# EAGLE schematic stern-dreieck-anlauf (EAGLE 6.0)
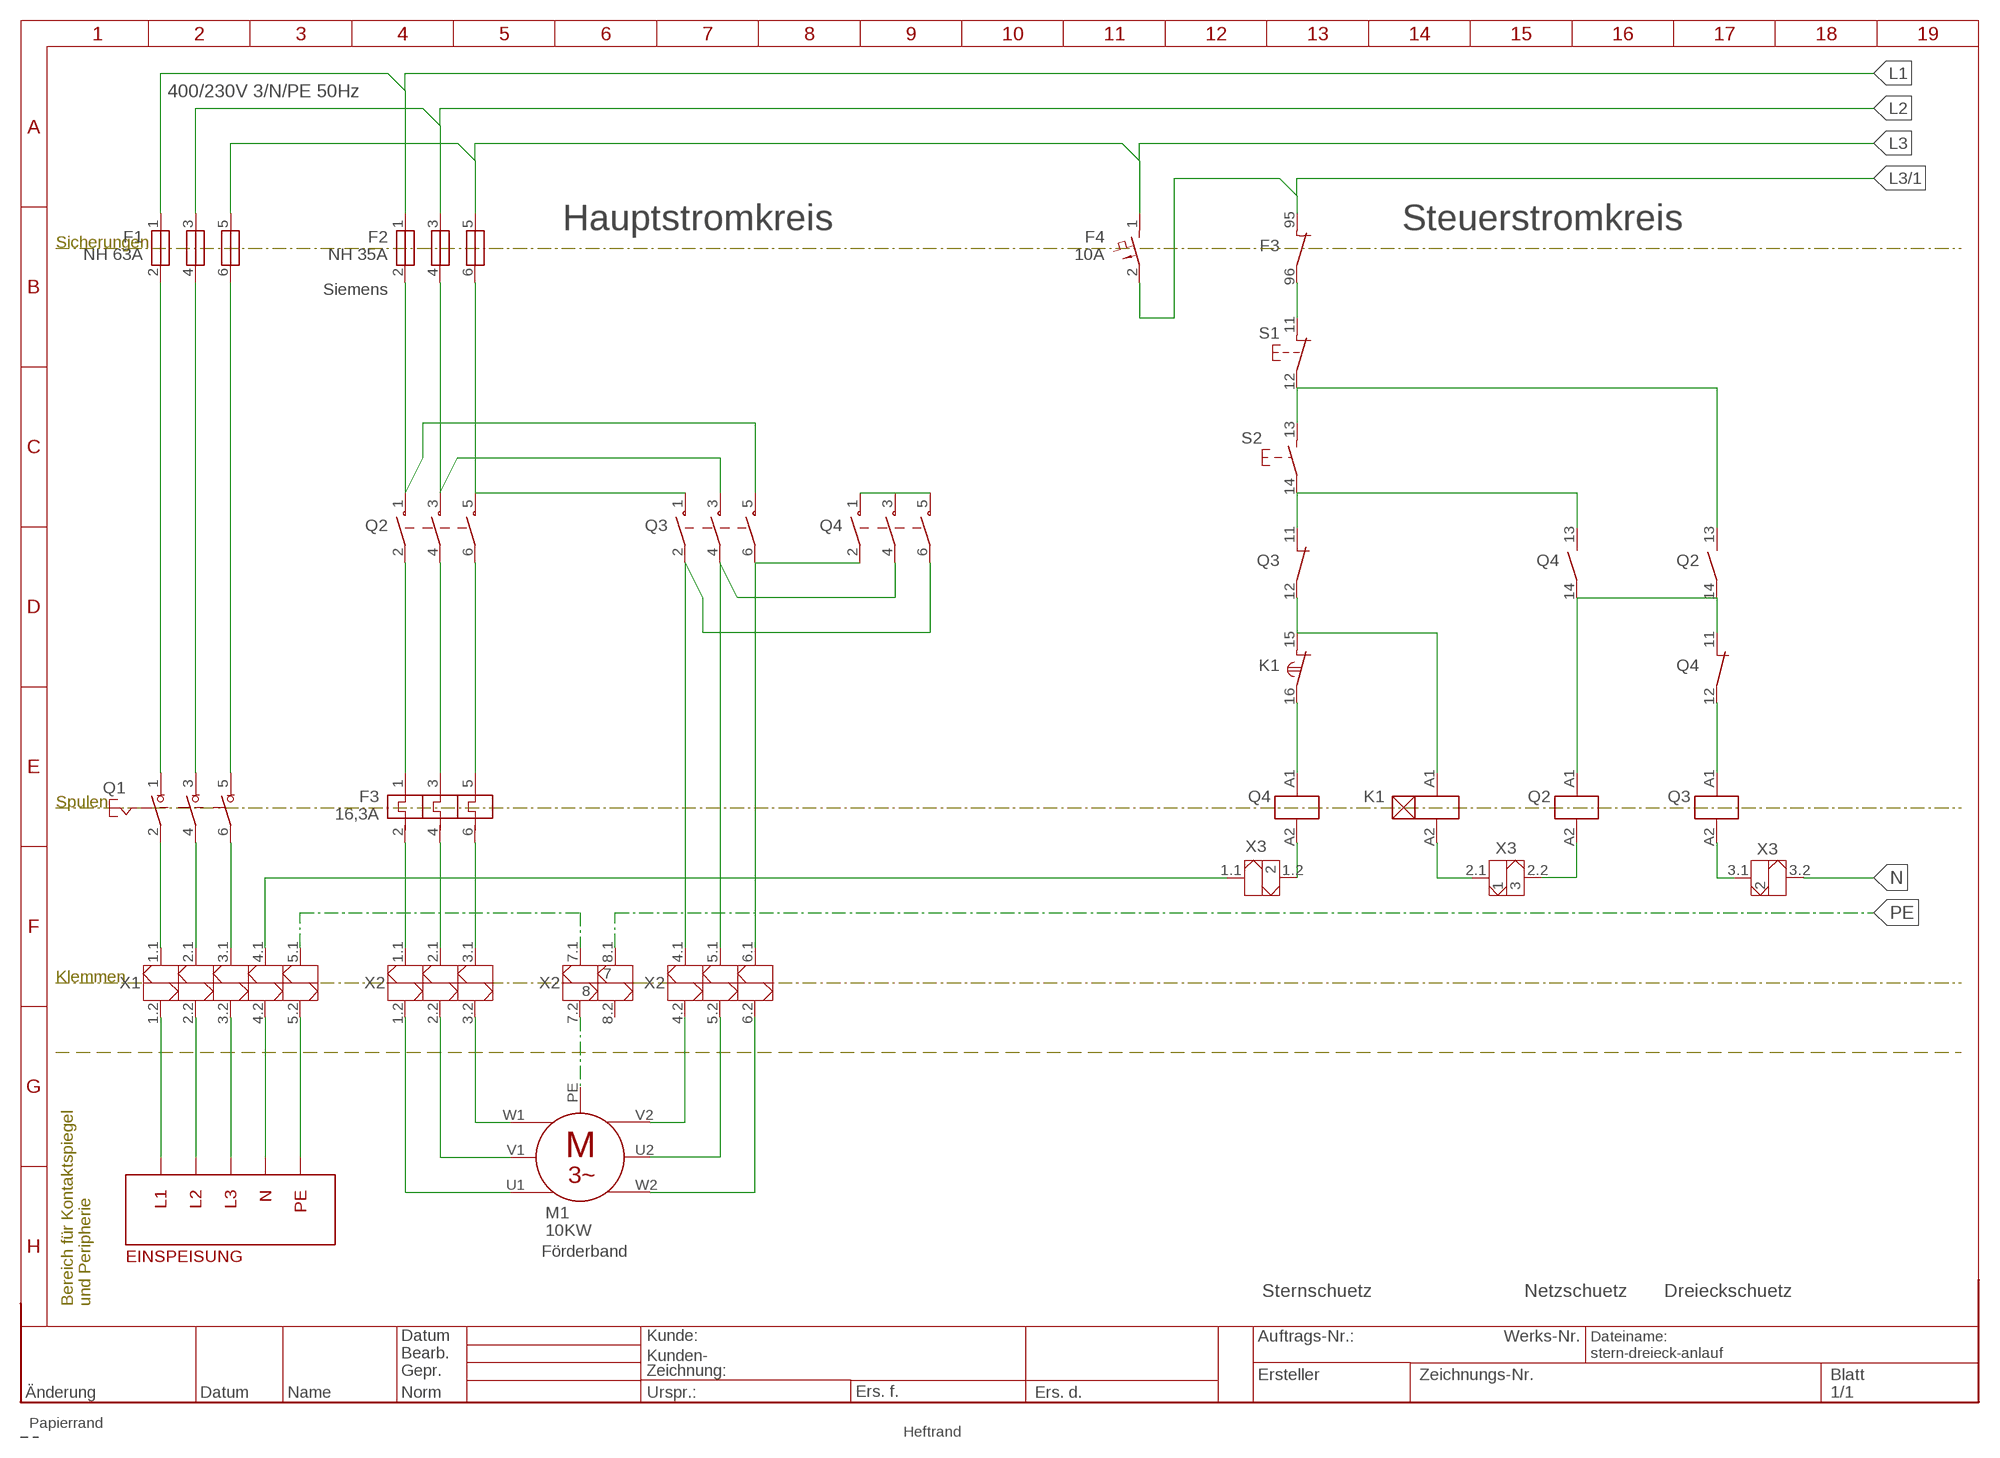
[diagram p0: schematic, sheet 1]

## Parts
F1  NH 63A  SICHERUNG_3-POL  [SICHERUNG_3-POL]
F2  NH 35A  SICHERUNG_3-POL  [SICHERUNG_3-POL]
F3  16,3A  MOTORSCHUTZSCHALTER_3-POL_THERM_AUSLOESUNG_HILFSKONTAKTE  [MOTORSCHUTZSCHALTER_3-POL_THERM_AUSLOESUNG_HILFSKONTAKT_95_96_97_98]
F4  10A  LEITUNGSSCHUTZSCHALTER  [LEITUNGSSCHUTZSCHALTER]
K1  HILFSSCHUETZ_OEFFNET_VERZOEGERT_15-16  [HILFSSCHUETZ_OEFFNET_VERZOEGERT_15-16]
M1  10KW  MOTOR_3-PHASEN_STERN-DREIECK-ANLAUF.ALTERNATIV  [MOTOR_3-PHASEN_STERN-DREIECK-ANLAUF.ALTERNATIV]
Q1  LASTTRENNSCHALTER_3-POL  [LASTTRENNSCHALTER_3-POL]
Q2  HAUPTSCHUETZ_3-POL_HILFSKONTAKT_13-14  [HAUPTSCHUETZ_3-POL+HILFSKONTAKT_13-14]
Q3  HAUPTSCHUETZ_3-POL_HILFSKONTAKT_11-12  [HAUPTSCHUETZ_3-POL+HILFSKONTAKT_11-12]
Q4  HAUPTSCHUETZ_3-POL_HILFSKONTAKT_11-12_13-14  [HAUPTSCHUETZ_3-POL+HILFSKONTAKT_12-12_13-14]
S1  TASTER_OEFFNER  [AUSTASTER]
S2  EINTASTER  [EINTASTER]
X1  KLEMME-2_6-BRUECKE  [KLEMME-2_6-BRUECKE]
X2  KLEMME-2_10-BRUECKE  [KLEMME-2_10-BRUECKE]
X3  KLEMME-2_6-BRUECKE  [KLEMME-2_6-BRUECKE]

## Nets
L1: F1.1 F2.1
L1-EXT: X1.1.2
L2: F1.3 F2.3
L2-EXT: X1.2.2
L3: F1.5 F2.5 F4.1
L3-EXT: X1.3.2
L3/1: F3.95 F4.2
N: X3.3.2
N$1: F1.2 Q1.1
N$2: Q3.11 Q4.13 S2.14(CS1)
N$3: F1.4 Q1.3
N$4: Q2.13 S1.12 S2.13(S1)
N$5: F1.6 Q1.5
N$6: F3.96 S1.11
N$7: F2.2 Q2.1 Q3.5
N$8: F3.1 Q2.2
N$9: M1.U1 X2.1.2
N$10: F2.4 Q2.3 Q3.3
N$11: F3.3 Q2.4
N$12: M1.V1 X2.2.2
N$13: F2.6 Q2.5 Q3.1
N$14: F3.5 Q2.6
N$15: M1.W1 X2.3.2
N$16: Q4.1 Q4.3 Q4.5
N$17: Q3.6 Q4.2 X2.6.1
N$18: Q3.4 Q4.4 X2.5.1
N$19: Q3.2 Q4.6 X2.4.1
N$20: K1.15 K1.A1 Q3.12
N$21: K1.16 Q4.A1
N$22: F3.2 X2.1.1
N$23: Q3.A1(1:A1) Q4.12
N$24: Q2.14 Q2.A1(1:A1) Q4.11 Q4.14
N$25: F3.4 X2.2.1
N$26: F3.6 X2.3.1
N$27: M1.V2 X2.4.2
N$28: M1.U2 X2.5.2
N$29: M1.W2 X2.6.2
N$30: Q1.2 X1.1.1
N$31: Q1.4 X1.2.1
N$32: Q1.6 X1.3.1
N$33: X1.4.1 X3.1.1
N$34: Q4.A2 X3.1.2
N$35: K1.A2 X3.2.1
N$36: Q2.A2(1:A2) X3.2.2
N$37: Q3.A2(1:A2) X3.3.1
N$39: X1.5.1 X2.7.1
N$40: M1.PE X2.7.2
N-EXT: X1.4.2
PE: X2.8.1
PE-EXT: X1.5.2
Unconnected: F3.97 F3.98 X1.6.1 X1.6.2 X2.8.2 X2.9.1 X2.9.2 X2.10.1 X2.10.2 X3.4.1 X3.4.2 X3.5.1 X3.5.2 X3.6.1 X3.6.2

## Notes on the sheet
- 400/230V 3/N/PE 50Hz
- Hauptstromkreis | Steuerstromkreis
- Sternschuetz | Netzschuetz | Dreieckschuetz

## Library data of the parts
F1 = e-sicherungen:SICHERUNG_3-POL: Sicherung, 3-pol.
F2 = e-sicherungen:SICHERUNG_3-POL: Sicherung, 3-pol.; HERSTELLER: Siemens
F3 = e-motorschutzschalter:MOTORSCHUTZSCHALTER_3-POL_THERM_AUSLOESUNG_HILFSKONTAKTE: Motorschutzschalter 3-pol. mit thermischer Auslösung, Hilfskontakte
F4 = e-sicherungen:LEITUNGSSCHUTZSCHALTER: Sicherung
K1 = e-schuetze-relais:HILFSSCHUETZ_OEFFNET_VERZOEGERT_15-16: Hilfsschütz mit Öffner, öffnet verzögert
M1 = e-motoren:MOTOR_3-PHASEN_STERN-DREIECK-ANLAUF.ALTERNATIV: 3-Phasen-Wechselstrom-Motor (alternativ); FUNKTION: Förderband
Q1 = e-schalter:LASTTRENNSCHALTER_3-POL: Lasttrennschalter, 3-pol.
Q2 = e-schuetze-relais:HAUPTSCHUETZ_3-POL_HILFSKONTAKT_13-14: Hauptschütz 3-pol. mit Hilfskontakt-Schließer
Q3 = e-schuetze-relais:HAUPTSCHUETZ_3-POL_HILFSKONTAKT_11-12: Hauptschütz 3-pol. mit Hilfskontakt Öffner
Q4 = e-schuetze-relais:HAUPTSCHUETZ_3-POL_HILFSKONTAKT_11-12_13-14: Hauptschütz mit Öffner und Schließer
S1 = e-schalter:TASTER_OEFFNER: Austaster (Ruhekontakt)
S2 = e-schalter:EINTASTER: Ein-Taster (Arbeitskontakt)
X1 = e-klemmen:KLEMME-2_6-BRUECKE: Klemme 6-pol. mit Brückenhinweis
X2 = e-klemmen:KLEMME-2_10-BRUECKE: Klemme 10-pol. mit Brückenhinweis; 72: 8; 81: 7
X3 = e-klemmen:KLEMME-2_6-BRUECKE: Klemme 6-pol. mit Brückenhinweis; 12: 2; 21: 1; 22: 3; 31: 2; NACH2: v22